# EasyEDA schematic SCH_Selectric-Conversion_2024-07-05.json
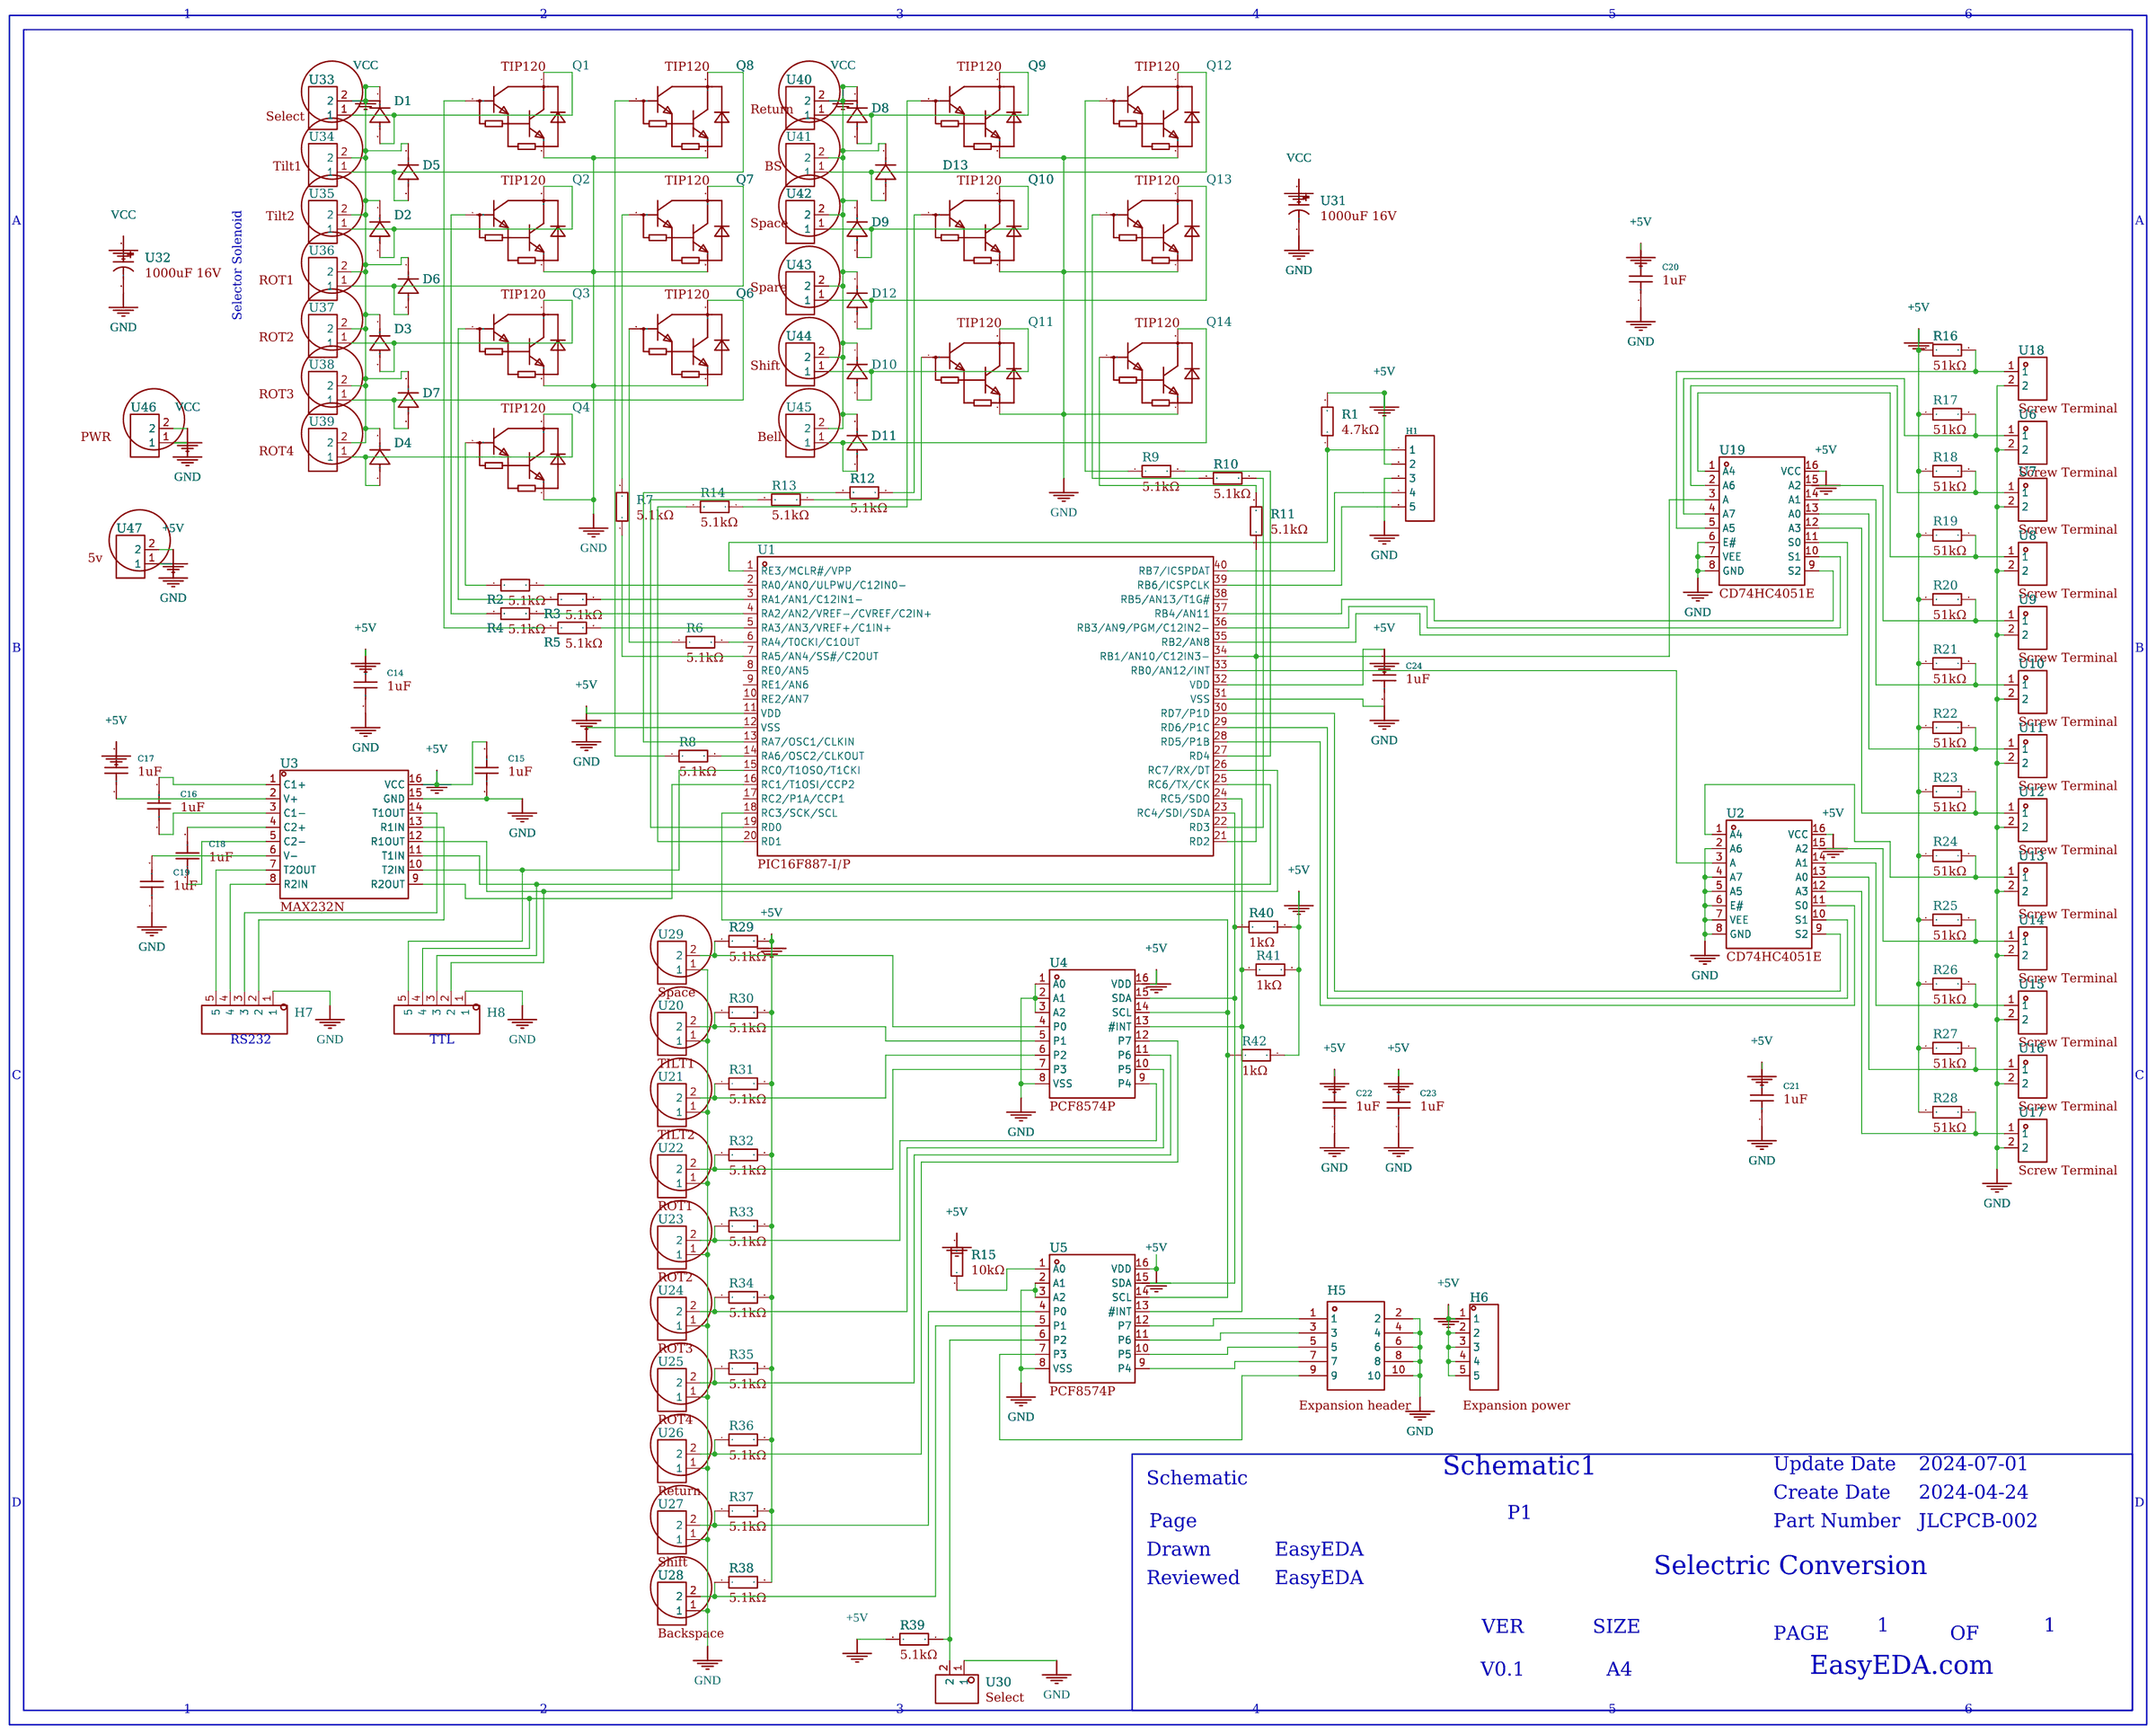
[diagram p0: schematic sheet]

## Parts
C14  1uF  [0]
C15  1uF  [0]
C16  1uF  [0]
C17  1uF  [0]
C18  1uF  [0]
C19  1uF  [0]
C20  1uF  [0]
C21  1uF  [0]
C22  1uF  [0]
C23  1uF  [0]
C24  1uF  [0]
D1  1N4007  [0]
D2  1N4007  [0]
D3  1N4007  [0]
D4  1N4007  [0]
D5  1N4007  [0]
D6  1N4007  [0]
D7  1N4007  [0]
D8  1N4007  [0]
D9  1N4007  [0]
D10  1N4007  [0]
D11  1N4007  [0]
D12  1N4007  [0]
D13  1N4007  [0]
H1  HDR-F_2.54_1x5P  [0]
H5  Expansion header  [0]
H6  Expansion power  [0]
H7  HDR-M_2.54_1x5P  [0]
H8  HDR-M_2.54_1x5P  [0]
Q1  TIP120  [0]
Q2  TIP120  [0]
Q3  TIP120  [0]
Q4  TIP120  [0]
Q6  TIP120  [0]
Q7  TIP120  [0]
Q8  TIP120  [0]
Q9  TIP120  [0]
Q10  TIP120  [0]
Q11  TIP120  [0]
Q12  TIP120  [0]
Q13  TIP120  [0]
Q14  TIP120  [0]
R1  4.7kΩ  [0]
R2  5.1kΩ  [0]
R3  5.1kΩ  [0]
R4  5.1kΩ  [0]
R5  5.1kΩ  [0]
R6  5.1kΩ  [0]
R7  5.1kΩ  [0]
R8  5.1kΩ  [0]
R9  5.1kΩ  [0]
R10  5.1kΩ  [0]
R11  5.1kΩ  [0]
R12  5.1kΩ  [0]
R13  5.1kΩ  [0]
R14  5.1kΩ  [0]
R15  10kΩ  [0]
R16  51kΩ  [0]
R17  51kΩ  [0]
R18  51kΩ  [0]
R19  51kΩ  [0]
R20  51kΩ  [0]
R21  51kΩ  [0]
R22  51kΩ  [0]
R23  51kΩ  [0]
R24  51kΩ  [0]
R25  51kΩ  [0]
R26  51kΩ  [0]
R27  51kΩ  [0]
R28  51kΩ  [0]
R29  5.1kΩ  [0]
R30  5.1kΩ  [0]
R31  5.1kΩ  [0]
R32  5.1kΩ  [0]
R33  5.1kΩ  [0]
R34  5.1kΩ  [0]
R35  5.1kΩ  [0]
R36  5.1kΩ  [0]
R37  5.1kΩ  [0]
R38  5.1kΩ  [0]
R39  5.1kΩ  [0]
R40  1kΩ  [0]
R41  1kΩ  [0]
R42  1kΩ  [0]
U1  PIC16F887-I/P  [0]
U2  CD74HC4051E  [0]
U3  MAX232N  [0]
U4  PCF8574P  [0]
U5  PCF8574P  [0]
U6  Screw Terminal  [0]
U7  Screw Terminal  [0]
U8  Screw Terminal  [0]
U9  Screw Terminal  [0]
U10  Screw Terminal  [0]
U11  Screw Terminal  [0]
U12  Screw Terminal  [0]
U13  Screw Terminal  [0]
U14  Screw Terminal  [0]
U15  Screw Terminal  [0]
U16  Screw Terminal  [0]
U17  Screw Terminal  [0]
U18  Screw Terminal  [0]
U19  CD74HC4051E  [0]
U20  TILT1  [0]
U21  TILT2  [0]
U22  ROT1  [0]
U23  ROT2  [0]
U24  ROT3  [0]
U25  ROT4  [0]
U26  Return  [0]
U27  Shift  [0]
U28  Backspace  [0]
U29  Space  [0]
U30  Select  [0]
U31  1000uF 16V  [0]
U32  1000uF 16V  [0]
U33  Select  [0]
U34  Tilt1  [0]
U35  Tilt2  [0]
U36  ROT1  [0]
U37  ROT2  [0]
U38  ROT3  [0]
U39  ROT4  [0]
U40  Return  [0]
U41  BS  [0]
U42  Space  [0]
U43  Spare  [0]
U44  Shift  [0]
U45  Bell  [0]
U46  PWR  [0]
U47  5v  [0]

## Library data of the parts
C14-C24 = -: Capacitance:100nF Tolerance:±20% Tolerance:±20% Voltage Rated: Lead Spacing: Temperature Coefficient: φD: Body Thickness:; Symbol: CC1H104MC1FD3F6C10MF; Device: CC1H104MC1FD3F6C10MF; Supplier: LCSC; Supplier Part: C254085; Manufacturer: Dersonic(德尔创); Manufacturer Part: CC1H104MC1FD3F6C10MF; JLCPCB Part Class: Extended Part; LCSC Part Name: 100nF ±20% 50V; Supplier Footprint: 插件,P=5.08mm; Datasheet: https://atta.szlcsc.com/upload/public/pdf/source/20200826/C254085_159DD65BF32BF11C9168D341BCE23E6F.pdf; Add into BOM: yes; Convert to PCB: yes; Tolerance: ±20%
D1-D13 = -: Symbol: D_1N4007; Convert to PCB: yes; Add into BOM: yes; Supplier Footprint: DO-41
H1 = -: Symbol: Header-Female-2.54_1x5; Supplier: LCSC; Manufacturer: BOOMELE(博穆精密); Manufacturer Part: 2.54-1*5P母; Supplier Part: C50950; JLCPCB Part Class: Extended Part; Convert to PCB: yes; Add into BOM: yes; Supplier Footprint: Through
H5 = -: Symbol: HDR-M-2.54_2x5; Device: HDR-M_2.54_2x5; Add into BOM: yes; Convert to PCB: yes; Supplier Footprint: Through
H6 = -: Symbol: MTP125-1105S1; Device: HDR-M_2.54_1x5P; Convert to PCB: yes; Add into BOM: yes; Supplier Footprint: Through
H7 H8 = -: Symbol: MTP125-1105S1; Convert to PCB: yes; Add into BOM: yes; Supplier Footprint: Through
Q1-Q4 Q6-Q14 = -: Transistor Type:NPN Collector-emitter voltage (Vceo):60V DC current gain (hFE@Vce,Ic):1000@3V,3A DC current gain (hFE@Vce,Ic):1000@3V,3A Power Dissipation (Pd):2W Collector Current (Ic):5A Transition frequency (fT):- Collector cut-off current (Icbo@Vcb):5; Device: TIP120_C262990; LCSC Part Name: NPN 耐压:60V 电流:5A; Supplier Part: C262990; Manufacturer: ST(意法半导体); Supplier Footprint: TO-220; JLCPCB Part Class: Extended Part; Datasheet: https://atta.szlcsc.com/upload/public/pdf/source/20180806/C262990_0EE67BD9C596AF827C63E15CA7C78F26.pdf; Supplier: LCSC; Add into BOM: yes; Convert to PCB: yes; Transistor Type: NPN; Collector-emitter voltage (Vceo): 60V; DC current gain (hFE@Vce,Ic): 1000@3V,3A; Power Dissipation (Pd): 2W; Collector Current (Ic): 5A; Collector cut-off current (Icbo@Vcb): 500uA; Collector-emitter saturation voltage (VCE(sat)@Ic,Ib): 4V@5A,20mA
R1-R42 = -: Symbol: Res; Device: Res_AXIAL-1/4W; Supplier Footprint: Through; Add into BOM: yes; Convert to PCB: yes
U1 = -: CPU Core:PIC Program Storage Size:14KB GPIO Ports Number:35 Operating Voltage Range:2V5.5V Operating Voltage Range:2V5.5V CPU Maximum Speed:20MHz Operating Temperature Range:-40℃+85℃ Operating Temperature Range:-40℃+85℃ ADC (Bit):10bit Watchdog:有 Low-; Supplier Part: C1337531; Manufacturer: MICROCHIP(美国微芯); Supplier Footprint: PDIP-40; JLCPCB Part Class: Extended Part; Datasheet: https://atta.szlcsc.com/upload/public/pdf/source/20180719/C220671_CD532A65A2F6F6B445C7E976F94E0D97.pdf; Supplier: LCSC; Add into BOM: yes; Convert to PCB: yes; CPU Core: PIC; Program Storage Size: 14KB; GPIO Ports Number: 35; Operating Voltage Range: 2V5.5V; CPU Maximum Speed: 20MHz; Operating Temperature Range: -40℃+85℃; ADC (Bit): 10bit; Watchdog: 有; Low-Voltage Detect: 有; Internal Oscillator: 有
U2 U19 = -: Number of Channels:1 Supply Voltage:2V6V Supply Voltage:2V6V On-State Resistance (Max):130Ω; Supplier Part: C205976; Manufacturer: TI(德州仪器); Supplier Footprint: PDIP-16; JLCPCB Part Class: Extended Part; Datasheet: https://www.ti.com/cn/lit/gpn/cd74hc4051; Supplier: LCSC; Add into BOM: yes; Convert to PCB: yes; Number of Channels: 1; Supply Voltage: 2V6V; On-State Resistance (Max): 130Ω
U3 = -: Types:transceiver Driver/receiver:2/2 Data Rate:120Kbps Data Rate:120Kbps Supply Voltage:4.5V5.5V Supply Voltage:4.5V5.5V Operating Temperature:0℃+70℃ Operating Temperature:0℃+70℃; Supplier Part: C353147; Manufacturer: TI(德州仪器); Supplier Footprint: PDIP-16; JLCPCB Part Class: Extended Part; Datasheet: https://www.ti.com/cn/lit/gpn/max232; Supplier: LCSC; Add into BOM: yes; Convert to PCB: yes; Types: transceiver; Driver/receiver: 2/2; Data Rate: 120Kbps; Supply Voltage: 4.5V5.5V; Operating Temperature: 0℃+70℃
U4 U5 = -: Interface:I2C Number of I/O:8 Interrupt Output:有中断输出 Output Type: Supply Voltage:2.5V6V Supply Voltage:2.5V6V Output Source current:300uA Output Sink Current:25mA Clock Frequency:100kHz Operating Temperature:-40℃+85℃ Operating Temperature:-40℃+85℃; LCSC Part Name: I2C总线 远程8位I/O扩展; Supplier Part: C398073; Manufacturer: HGSEMI(华冠); Supplier Footprint: DIP-16; JLCPCB Part Class: Extended Part; Datasheet: https://atta.szlcsc.com/upload/public/pdf/source/20190611/C398075_1925312D8618E19C6137781D5B71A3CA.pdf; Supplier: LCSC; Add into BOM: yes; Convert to PCB: yes; Interface: I2C; Number of I/O: 8; Interrupt Output: 有中断输出; Supply Voltage: 2.5V6V; Output Source current: 300uA; Output Sink Current: 25mA; Clock Frequency: 100kHz; Operating Temperature: -40℃+85℃
U6-U18 U20-U30 U33-U47 = -: Structure:1x2P Pitch:5mm Color:Green Mounting Style:Straight Current Rating (Max):20A Voltage Rating (Max):300V Number of Pins:2P Number of Rows:1 Wire Gauge - AWG:1230 Wire Gauge - AWG:1230 Wire Gauge - mm2:2.5 Wire Gauge - mm2:2.5 Number of PINs Per R; Symbol: DB128V-5.0-2P; Device: DB128V-5.0-2P-GN-S; LCSC Part Name: 5mm 1x2P 排数:1 每排P数:2 直插; Supplier Part: C395860; Manufacturer: DORABO(地博电气); Manufacturer Part: DB128V-5.0-2P-GN-S; Supplier Footprint: 插件,P=5mm; JLCPCB Part Class: Extended Part; Datasheet: https://atta.szlcsc.com/upload/public/pdf/source/20230106/1C26AF647DE84A253DB7E5AA54EB19EE.pdf; Supplier: LCSC; Add into BOM: yes; Convert to PCB: yes; Structure: 1x2P; Pitch: 5mm; Color: Green; Mounting Style: Straight; Current Rating (Max): 20A; Voltage Rating (Max): 300V; Number of Pins: 2P; Number of Rows: 1; Wire Gauge - AWG: 1230; Wire Gauge - mm2: 2.5; Number of PINs Per Row: 2; Operating Temperature Range: -40℃+105℃
U31 U32 = -: Symbol: 1000UF 16V_C439782; Supplier Part: C439782; Manufacturer: CX(承兴); Supplier Footprint: 插件,D10xL13mm; JLCPCB Part Class: Extended Part; Supplier: LCSC; Add into BOM: yes; Convert to PCB: yes

## Nets
+5V: C14.2 C15.2 C17.2 C20.2 C21.2 C22.2 C23.2 C24.2 H1.2 H6.1 H6.2 H6.3 H6.4 H6.5 R1.2 R15.2 R16.1 R17.1 R18.1 R19.1 R20.1 R21.1 R22.1 R23.1 R24.1 R25.1 R26.1 R27.1 R28.1 R29.2 R30.2 R31.2 R32.2 R33.2 R34.2 R35.2 R36.2 R37.2 R38.2 R39.1 R40.2 R41.2 R42.2 U1.11(VDD) U1.32(VDD) U2.16(VCC) U3.16(VCC) U4.16(VDD) U5.16(VDD) U19.16(VCC) U47.2
GND: C14.1 C15.1 C19.1 C20.1 C21.1 C22.1 C23.1 C24.1 H1.3 H5.2 H5.4 H5.6 H5.8 H5.10 H7.1 H8.1 Q1.3(E) Q2.3(E) Q3.3(E) Q4.3(E) Q6.3(E) Q7.3(E) Q8.3(E) Q9.3(E) Q10.3(E) Q11.3(E) Q12.3(E) Q13.3(E) Q14.3(E) U1.12(VSS) U1.31(VSS) U2.2(A6) U2.4(A7) U2.5(A5) U2.6(E#) U2.7(VEE) U2.8(GND) U3.15(GND) U4.1(A0) U4.2(A1) U4.3(A2) U4.8(VSS) U5.2(A1) U5.3(A2) U5.8(VSS) U6.2 U7.2 U8.2 U9.2 U10.2 U11.2 U12.2 U13.2 U14.2 U15.2 U16.2 U17.2 U18.2 U19.6(E#) U19.7(VEE) U19.8(GND) U20.1 U21.1 U22.1 U23.1 U24.1 U25.1 U26.1 U27.1 U28.1 U29.1 U30.1 U31.2 U32.2 U46.1 U47.1
VCC: D1.1(K) D2.1(K) D3.1(K) D4.1(K) D5.1(K) D6.1(K) D7.1(K) D8.1(K) D9.1(K) D10.1(K) D11.1(K) D12.1(K) D13.1(K) U31.1 U32.1 U33.2 U34.2 U35.2 U36.2 U37.2 U38.2 U39.2 U40.2 U41.2 U42.2 U43.2 U44.2 U45.2 U46.2
Net-(C16-1): C16.1 U3.3(C1-)
Net-(C16-2): C16.2 U3.1(C1+)
Net-(C17-1): C17.1 U3.2(V+)
Net-(C18-1): C18.1 U3.5(C2-)
Net-(C18-2): C18.2 U3.4(C2+)
Net-(C19-2): C19.2 U3.6(V-)
Net-(D1-2): D1.2(A) Q1.2(C) U33.1
Net-(D2-2): D2.2(A) Q2.2(C) U35.1
Net-(D3-2): D3.2(A) Q3.2(C) U37.1
Net-(D4-2): D4.2(A) Q4.2(C) U39.1
Net-(D5-2): D5.2(A) Q8.2(C) U34.1
Net-(D6-2): D6.2(A) Q7.2(C) U36.1
Net-(D7-2): D7.2(A) Q6.2(C) U38.1
Net-(D8-2): D8.2(A) Q9.2(C) U40.1
Net-(D9-2): D9.2(A) Q10.2(C) U42.1
Net-(D10-2): D10.2(A) Q11.2(C) U44.1
Net-(D11-2): D11.2(A) Q14.2(C) U45.1
Net-(D12-2): D12.2(A) Q13.2(C) U43.1
Net-(D13-2): D13.2(A) Q12.2(C) U41.1
Net-(H1-1): H1.1 R1.1 U1.1(RE3/MCLR#/VPP)
Net-(H1-4): H1.4 U1.40(RB7/ICSPDAT)
Net-(H1-5): H1.5 U1.39(RB6/ICSPCLK)
Net-(H5-1): H5.1 U5.12(P7)
Net-(H5-3): H5.3 U5.11(P6)
Net-(H5-5): H5.5 U5.10(P5)
Net-(H5-7): H5.7 U5.9(P4)
Net-(H5-9): H5.9 U5.7(P3)
Net-(H7-2): H7.2 U3.13(R1IN)
Net-(H7-3): H7.3 U3.14(T1OUT)
Net-(H7-4): H7.4 U3.8(R2IN)
Net-(H7-5): H7.5 U3.7(T2OUT)
Net-(H8-2): H8.2 U1.26(RC7/RX/DT) U3.12(R1OUT)
Net-(H8-3): H8.3 U1.25(RC6/TX/CK) U3.11(T1IN)
Net-(H8-4): H8.4 U1.16(RC1/T1OSI/CCP2) U3.9(R2OUT)
Net-(H8-5): H8.5 U1.15(RC0/T1OSO/T1CKI) U3.10(T2IN)
Net-(Q1-1): Q1.1(B) R5.1
Net-(Q2-1): Q2.1(B) R4.1
Net-(Q3-1): Q3.1(B) R3.1
Net-(Q4-1): Q4.1(B) R2.1
Net-(Q6-1): Q6.1(B) R6.1
Net-(Q7-1): Q7.1(B) R7.2
Net-(Q8-1): Q8.1(B) R8.1
Net-(Q9-1): Q9.1(B) R14.1
Net-(Q10-1): Q10.1(B) R12.1
Net-(Q11-1): Q11.1(B) R13.1
Net-(Q12-1): Q12.1(B) R9.1
Net-(Q13-1): Q13.1(B) R10.1
Net-(Q14-1): Q14.1(B) R11.2
Net-(R2-2): R2.2 U1.2(RA0/AN0/ULPWU/C12IN0-)
Net-(R3-2): R3.2 U1.3(RA1/AN1/C12IN1-)
Net-(R4-2): R4.2 U1.4(RA2/AN2/VREF-/CVREF/C2IN+)
Net-(R5-2): R5.2 U1.5(RA3/AN3/VREF+/C1IN+)
Net-(R6-2): R6.2 U1.6(RA4/T0CKI/C1OUT)
Net-(R7-1): R7.1 U1.7(RA5/AN4/SS#/C2OUT)
Net-(R8-2): R8.2 U1.14(RA6/OSC2/CLKOUT)
Net-(R9-2): R9.2 U1.27(RD4)
Net-(R10-2): R10.2 U1.22(RD3)
Net-(R11-1): R11.1 U1.21(RD2) U1.34(RB1/AN10/C12IN3-) U19.3(A)
Net-(R12-2): R12.2 U1.13(RA7/OSC1/CLKIN)
Net-(R13-2): R13.2 U1.19(RD0)
Net-(R14-2): R14.2 U1.20(RD1)
Net-(R15-1): R15.1 U5.1(A0)
Net-(R16-2): R16.2 U18.1 U19.5(A5)
Net-(R17-2): R17.2 U6.1 U19.4(A7)
Net-(R18-2): R18.2 U7.1 U19.2(A6)
Net-(R19-2): R19.2 U8.1 U19.1(A4)
Net-(R20-2): R20.2 U9.1 U19.15(A2)
Net-(R21-2): R21.2 U10.1 U19.14(A1)
Net-(R22-2): R22.2 U11.1 U19.13(A0)
Net-(R23-2): R23.2 U12.1 U19.12(A3)
Net-(R24-2): R24.2 U2.1(A4) U13.1
Net-(R25-2): R25.2 U2.15(A2) U14.1
Net-(R26-2): R26.2 U2.14(A1) U15.1
Net-(R27-2): R27.2 U2.13(A0) U16.1
Net-(R28-2): R28.2 U2.12(A3) U17.1
Net-(R29-1): R29.1 U4.4(P0) U29.2
Net-(R30-1): R30.1 U4.5(P1) U20.2
Net-(R31-1): R31.1 U4.6(P2) U21.2
Net-(R32-1): R32.1 U4.7(P3) U22.2
Net-(R33-1): R33.1 U4.9(P4) U23.2
Net-(R34-1): R34.1 U4.10(P5) U24.2
Net-(R35-1): R35.1 U4.11(P6) U25.2
Net-(R36-1): R36.1 U4.12(P7) U26.2
Net-(R37-1): R37.1 U5.4(P0) U27.2
Net-(R38-1): R38.1 U5.5(P1) U28.2
Net-(R39-2): R39.2 U5.6(P2) U30.2
Net-(R40-1): R40.1 U1.23(RC4/SDI/SDA) U4.15(SDA) U5.15(SDA)
Net-(R41-1): R41.1 U1.24(RC5/SDO) U4.13(#INT) U5.13(#INT)
Net-(R42-1): R42.1 U1.18(RC3/SCK/SCL) U4.14(SCL) U5.14(SCL)
Net-(U1-28): U1.28(RD5/P1B) U2.11(S0)
Net-(U1-29): U1.29(RD6/P1C) U2.10(S1)
Net-(U1-30): U1.30(RD7/P1D) U2.9(S2)
Net-(U1-33): U1.33(RB0/AN12/INT) U2.3(A)
Net-(U1-35): U1.35(RB2/AN8) U19.11(S0)
Net-(U1-36): U1.36(RB3/AN9/PGM/C12IN2-) U19.10(S1)
Net-(U1-37): U1.37(RB4/AN11) U19.9(S2)

Not connected (* = marked no-connect by the designer): U1 8(RE0/AN5) 9(RE1/AN6) 10(RE2/AN7) 17(RC2/P1A/CCP1) 38(RB5/AN13/T1G#)

## Notes on the sheet
- 1
- 2
- 3
- 4
- 5
- 6
- A
- A
- Selector Solenoid
- B
- B
- RS232
- TTL
- C
- C
- Schematic1
- Update Date
- 2024-07-01
- Schematic
- Create Date
- 2024-04-24
- D
- P1
- D
- Page
- Part Number
- JLCPCB-002
- Drawn
- EasyEDA
- Selectric Conversion
- Reviewed
- EasyEDA
- VER
- SIZE
- PAGE
- 1
- OF
- 1
- EasyEDA.com
- V0.1
- A4
- 1
- 2
- 3
- 4
- 5
- 6
